# Altium schematic sheet DEVICES.SchDoc
size A4
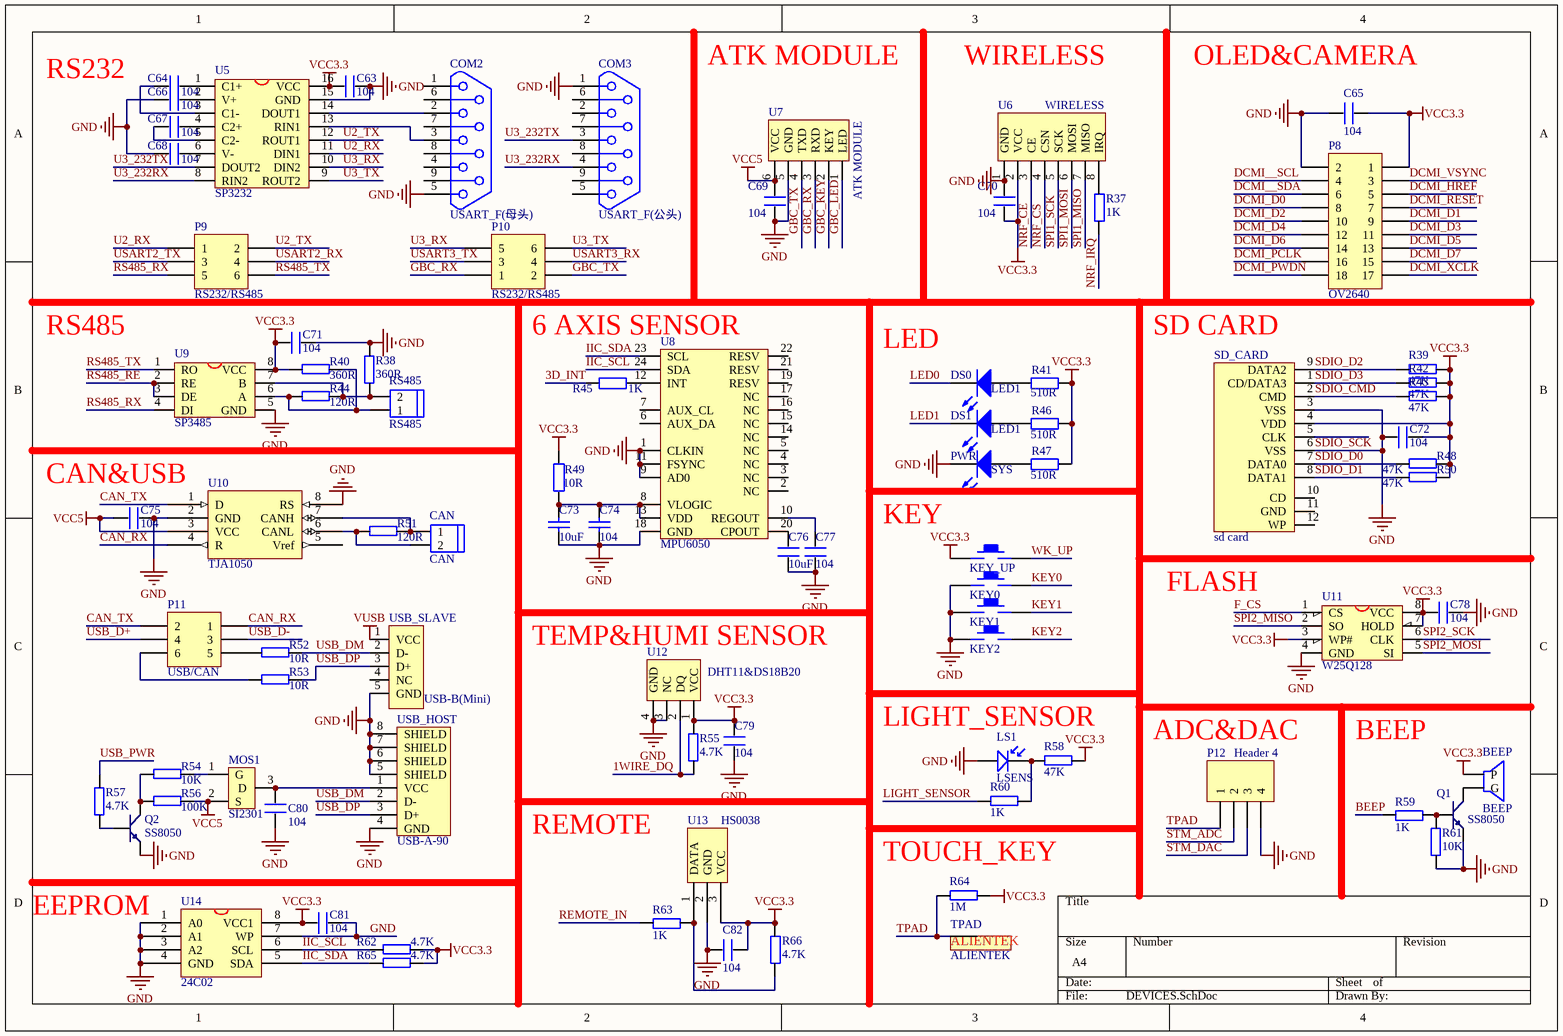
[diagram p0: DEVICES.SchDoc]

## Parts
BEEP  BEEP  [BELL-5]
C63  104  [R0603]
C64  104  [R0603]
C65  104  [R0603]
C66  104  [R0603]
C67  104  [R0603]
C68  104  [R0603]
C69  104  [R0603]
C70  104  [R0603]
C71  104  [R0603]
C72  104  [R0603]
C73  10uF  [1206]
C74  104  [R0603]
C75  104  [R0603]
C76  10uF  [1206]
C77  104  [R0603]
C78  104  [R0603]
C79  104  [R0603]
C80  104  [R0603]
C81  104  [R0603]
C82  104  [R0603]
CAN  CAN  [HEAD2L-0.8]
COM2  USART_F(母头)  [DB9]
COM3  USART_F(公头)  [DB9]
DS0  LED1  [SMDLED]
DS1  LED1  [SMDLED]
KEY0  KEY_M  [KEY_M]  (value not drawn)
KEY1  KEY_M  [KEY_M]  (value not drawn)
KEY2  KEY_M  [KEY_M]  (value not drawn)
KEY_UP  KEY_M  [KEY_M]  (value not drawn)
LS1  LSENS  [SMDLED]
MOS1  SI2301  [SO-G3/C2.5]
P8  OV2640  [HDR2X9]
P9  RS232/RS485  [HDR2X3]
P10  RS232/RS485  [HDR2X3]
P11  USB/CAN  [HDR2X3]
P12  Header 4  [HDR1X4]
PWR  SYS  [SMDLED]
Q1  SS8050  [SOT23-3]
Q2  SS8050  [SOT23-3]
R37  1K  [R0603]
R38  360R  [R0603]
R39  47K  [R0603]
R40  360R  [R0603]
R41  510R  [R0603]
R42  47K  [R0603]
R43  47K  [R0603]
R44  120R  [R0603]
R45  1K  [R0603]
R46  510R  [R0603]
R47  510R  [R0603]
R48  47K  [R0603]
R49  10R  [R0603]
R50  47K  [R0603]
R51  120R  [R0603]
R52  10R  [R0603]
R53  10R  [R0603]
R54  10K  [R0603]
R55  4.7K  [R0603]
R56  100K  [R0603]
R57  4.7K  [R0603]
R58  47K  [R0603]
R59  1K  [R0603]
R60  1K  [R0603]
R61  10K  [R0603]
R62  4.7K  [R0603]
R63  1K  [R0603]
R64  1M  [R0603]
R65  4.7K  [R0603]
R66  4.7K  [R0603]
RS485  RS485  [HEAD2L-0.8]
SD_CARD  sd card  [SDCARD_L]
TPAD  ALIENTEK  [ALIENTEK_PAD2]
U5  SP3232  [SOP16M]
U6  WIRELESS  [NRF24L01]
U7  ATK MODULE  [HEAD6]
U8  MPU6050  [QFN24]
U9  SP3485  [SOP-8]
U10  TJA1050  [SOP-8]
U11  W25Q128  [SOIC-8]
U12  DHT11&DS18B20  [DHT11]
U13  HS0038  [HS0038]
U14  24C02  [SOP-8]
USB_HOST  USB-A-90  [USB-A-90]
USB_SLAVE  USB-B(Mini)  [MiniUSB/SM0.8-6H5]

## Nets
GND: C63.2 C65.2 C66.1 C68.1 C69.1 C70.2 C71.2 C72.2 C73.1 C74.1 C75.2 C76.1 C77.1 C78.1 C79.1 C80.1 C81.1 C82.2 COM2.5 COM3.1 KEY0.2 KEY1.2 KEY2.2 LS1.1 P8.2 P12.4 PWR.2(K) Q1.2(E) Q2.2(E) R38.1 R61.2 SD_CARD.3(VSS) SD_CARD.6(VSS) U5.15(GND) U6.1(GND) U7.5(GND) U8.1(CLKIN) U8.9(AD0) U8.11(FSYNC) U8.18(GND) U9.5(GND) U10.2(GND) U10.8(RS) U11.4(GND) U12.3(NC) U12.4(GND) U13.2(GND) U14.1(A0) U14.2(A1) U14.3(A2) U14.4(GND) U14.7(WP) USB_HOST.4(GND) USB_HOST.5(SHIELD) USB_HOST.6(SHIELD) USB_HOST.7(SHIELD) USB_HOST.8(SHIELD) USB_SLAVE.5(GND)  [also labelled SDIO_SCK]
VCC3.3: BEEP.1(P) C63.1 C65.1 C70.1 C71.1 C72.1 C78.2 C79.2 C81.2 C82.1 KEY_UP.2 P8.1 R39.1 R40.2 R41.1 R42.1 R43.1 R46.1 R47.1 R48.1 R49.2 R50.1 R55.1 R58.1 R62.1 R64.1 R65.1 R66.2 SD_CARD.4(VDD) U5.16(VCC) U6.2(VCC) U9.8(VCC) U11.3(WP#) U11.7(HOLD) U11.8(VCC) U12.1(VCC) U13.3(VCC) U14.8(VCC1)
VCC5: C69.2 C75.1 MOS1.2(S) R56.1 U7.6(VCC) U10.3(VCC)
VUSB: USB_SLAVE.1(VCC)
1WIRE_DQ: R55.2 U12.2(DQ)
3D_INT: R45.2
BEEP: R59.1
CAN_RX: P11.1 U10.4(R)
CAN_TX: P11.2 U10.1(D)
DCMI__SCL: P8.4
DCMI__SDA: P8.6
DCMI_D0: P8.8
DCMI_D1: P8.9
DCMI_D2: P8.10
DCMI_D3: P8.11
DCMI_D4: P8.12
DCMI_D5: P8.13
DCMI_D6: P8.14
DCMI_D7: P8.15
DCMI_HREF: P8.5
DCMI_PCLK: P8.16
DCMI_PWDN: P8.18
DCMI_RESET: P8.7
DCMI_VSYNC: P8.3
DCMI_XCLK: P8.17
F_CS: U11.1(CS)
GBC_KEY: U7.2(KEY)
GBC_LED: U7.1(LED)
GBC_RX: P10.1 U7.3(RXD)
GBC_TX: P10.2 U7.4(TXD)
IIC_SCL: R62.2 U8.24(SDA) U14.6(SCL)
IIC_SDA: R65.2 U8.23(SCL) U14.5(SDA)
KEY0: KEY0.1
KEY1: KEY1.1
KEY2: KEY2.1
LED0: DS0.2(K)
LED1: DS1.2(K)
LIGHT_SENSOR: R60.2
NRF_CE: U6.3(CE)
NRF_CS: U6.4(CSN)
NRF_IRQ: R37.1
REMOTE_IN: R63.1
RS485_RE: U9.2(RE) U9.3(DE)
RS485_RX: P9.5 U9.4(DI)
RS485_TX: P9.6 U9.1(RO)
SDIO_CMD: R43.2 SD_CARD.2(CMD)
SDIO_D0: R48.2 SD_CARD.7(DATA0)
SDIO_D1: R50.2 SD_CARD.8(DATA1)
SDIO_D2: R39.2 SD_CARD.9(DATA2)
SDIO_D3: R42.2 SD_CARD.1(CD/DATA3)
SPI1_MISO: U6.7(MISO)
SPI1_MOSI: U6.6(MOSI)
SPI1_SCK: U6.5(SCK)
SPI2_MISO: U11.2(SO)
SPI2_MOSI: U11.5(SI)
SPI2_SCK: U11.6(CLK)
STM_ADC: P12.2
STM_DAC: P12.3
TPAD: P12.1 R64.2 TPAD.1
U2_RX: P9.1 U5.11(DIN1)
U2_TX: P9.2 U5.12(ROUT1)
U3_232RX: COM3.4 U5.8(RIN2)
U3_232TX: COM3.3 U5.7(DOUT2)
U3_RX: P10.5 U5.10(DIN2)
U3_TX: P10.6 U5.9(ROUT2)
USART2_RX: P9.4
USART2_TX: P9.3
USART3_RX: P10.4
USART3_TX: P10.3
USB_D+: P11.4
USB_D-: P11.3
USB_DM: R52.1 USB_HOST.2(D-) USB_SLAVE.2(D-)
USB_DP: R53.1 USB_HOST.3(D+) USB_SLAVE.3(D+)
USB_PWR: R57.1
WK_UP: KEY_UP.1
NetBEEP_2: BEEP.2(G) Q1.3(C)
NetC64_1: C64.1 U5.3(C1-)
NetC64_2: C64.2 U5.1(C1+)
NetC66_2: C66.2 U5.2(V+)
NetC67_1: C67.1 U5.5(C2-)
NetC67_2: C67.2 U5.4(C2+)
NetC68_2: C68.2 U5.6(V-)
NetC73_2: C73.2 C74.2 R49.1 U8.8(VLOGIC) U8.13(VDD)
NetC76_2: C76.2 U8.20(CPOUT)
NetC77_2: C77.2 U8.10(REGOUT)
NetC80_2: C80.2 MOS1.3(D) USB_HOST.1(VCC)
NetCAN_1: CAN.1 R51.1 U10.7(CANH)
NetCAN_2: CAN.2 R51.2 U10.6(CANL)
NetCOM2_2: COM2.2 U5.14(DOUT1)
NetCOM2_3: COM2.3 U5.13(RIN1)
NetDS0_1: DS0.1(A) R41.2
NetDS1_1: DS1.1(A) R46.2
NetLS1_2: LS1.2 R58.2 R60.1
NetMOS1_1: MOS1.1(G) R54.1
NetP11_5: P11.5 R52.2
NetP11_6: P11.6 R53.2
NetPWR_1: PWR.1(A) R47.2
NetQ1_1: Q1.1(B) R59.2 R61.1
NetQ2_1: Q2.1(B) R57.2
NetQ2_3: Q2.3(C) R54.2 R56.2
NetR37_2: R37.2 U6.8(IRQ)
NetR38_2: R38.2 R44.1 RS485.2 U9.7(B)
NetR40_1: R40.1 R44.2 RS485.1 U9.6(A)
NetR45_1: R45.1 U8.12(INT)
NetR63_2: R63.2 R66.1 U13.1(DATA)

Not connected (* = marked no-connect by the designer): COM2 1 4 6 7 8 9; COM3 2 5 6 7 8 9; SD_CARD 5(CLK) 10(CD) 11(GND) 12(WP); U8 2(NC) 3(NC) 4(NC) 5(NC) 6(AUX_DA) 7(AUX_CL) 14(NC) 15(NC) 16(NC) 17(NC) 19(RESV) 21(RESV) 22(RESV); U10 5(Vref); USB_SLAVE 4(NC)

## Notes on the sheet
- RS232
- ATK MODULE
- WIRELESS
- (near C65) OLED&CAMERA
- RS485
- (near U8) 6 AXIS SENSOR
- LED
- (near SD_CARD) SD CARD
- (near C75) CAN&USB
- KEY
- TEMP&HUMI SENSOR
- FLASH
- LIGHT_SENSOR
- ADC&DAC
- BEEP
- REMOTE
- EEPROM
- TOUCH_KEY

## Library data of the parts
C63-C72 C75-C82 = C
C73 C74 = Cap Semi: Capacitor (Semiconductor SIM Model); Value: 100nF
CAN RS485 = HEAD2
COM2 COM3 = DB9
DS0 DS1 PWR = LED2: Typical RED, GREEN, YELLOW, AMBER GaAs LED; Published: 8-Jun-2000; LatestRevisionDate: 17-Jul-2002; LatestRevisionNote: Re-released for DXP Platform.; PackageDocument: Feb-2002; PackageReference: 3.2X1.6X1.1; Publisher: Altium Limited
LS1 = LSENS: LIGHT SENS
MOS1 = MOS-P: IRLML6401/SI2301
P8 = Header 9X2: Header, 9-Pin, Dual row; LatestRevisionDate: 17-Jul-2002; LatestRevisionNote: Re-released for DXP Platform.; Publisher: Altium Limited
P9-P11 = Header 3X2: Header, 3-Pin, Dual row; LatestRevisionDate: 17-Jul-2002; LatestRevisionNote: Re-released for DXP Platform.; Publisher: Altium Limited
P12 = Header 4: Header, 4-Pin; LatestRevisionDate: 17-Jul-2002; LatestRevisionNote: Re-released for DXP Platform.; Publisher: Altium Limited
R37-R40 R42-R44 R48 R50-R66 = R
R41 R45-R47 R49 = Res2: Resistor; Value: 10K; Published: 8-Jun-2000; LatestRevisionDate: 17-Jul-2002; LatestRevisionNote: Re-released for DXP Platform.; PackageReference: AXIAL-0.4; Publisher: Altium Limited
TPAD = TPAD: ALIENTEK TPAD
U5 = MAX3232
U6 = NRF24L01
U7 = ATK-HC05
U8 = MPU6050: 9轴运动处理传感器
U9 = MAX3485
U10 = SN65HVD230D
U11 = W25X16: W25X16;SST25VF016;MX25L1605
U12 = DHT11: 数字温湿度传感器
U14 = 24C256
USB_HOST = USB_A_90
USB_SLAVE = USB5